# Altium project ADL5330_VGA.PrjPcb
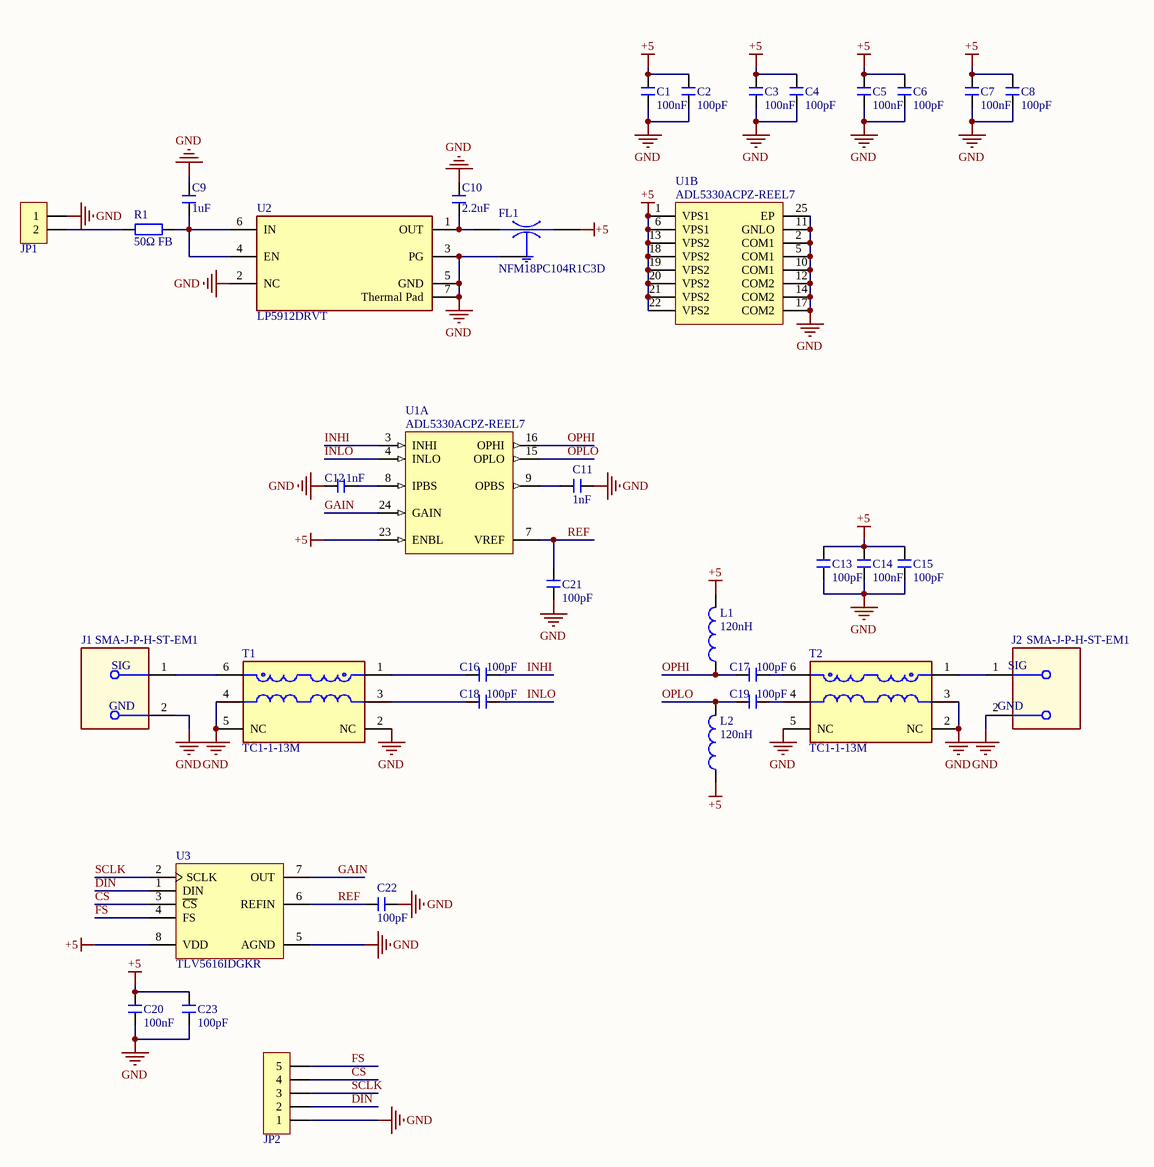
[diagram p0: ADL5330.SchDoc]
1 sheet, 36 parts. Net scope: global (net labels, ports and power ports of the same name join across sheets).
Board file: ADL5330.PcbDoc

## Sheet ADL5330.SchDoc
size A2; SheetNumber: 1; SheetTotal: 1

### Parts
C1  100nF  [C 0402_L]
C2  100pF  [C 0402_L]
C3  100nF  [C 0402_L]
C4  100pF  [C 0402_L]
C5  100nF  [C 0402_L]
C6  100pF  [C 0402_L]
C7  100nF  [C 0402_L]
C8  100pF  [C 0402_L]
C9  1uF  [C 0603_L]
C10  2.2uF  [C 0603_L]
C11  1nF  [C 0402_L]
C12  1nF  [C 0402_L]
C13  100pF  [C 0402_L]
C14  100nF  [C 0402_L]
C15  100pF  [C 0402_L]
C16  100pF  [C 0402_L]
C17  100pF  [C 0402_L]
C18  100pF  [C 0402_L]
C19  100pF  [C 0402_L]
C20  100nF  [C 0402_L]
C21  100pF  [C 0402_L]
C22  100pF  [C 0402_L]
C23  100pF  [C 0402_L]
FL1  NFM18PC104R1C3D  [FIL_NFM18PC104R1C3D]
J1  SMA-J-P-H-ST-EM1  [FP-SMA-J-P-H-ST-EM1-MFG]
J2  SMA-J-P-H-ST-EM1  [FP-SMA-J-P-H-ST-EM1-MFG]
JP1  HDR-1X2  [KF2510-LI-2P]  (value not drawn)
JP2  HDR-1X5  [HDR2.54-LI-5P]  (value not drawn)
L1  120nH  [L 0603]
L2  120nH  [L 0603]
R1  50Ω FB  [R 1206_L]
T1  TC1-1-13M  [FP-TC1-1-13M+-MFG]
T2  TC1-1-13M  [FP-TC1-1-13M+-MFG]
U1  ADL5330ACPZ-REEL7  [ADI-CP-24-2_L]  (parts A,B of 2)
U2  LP5912DRVT  [FP-DRV0006A-MFG]
U3  TLV5616IDGKR  [TI-DGK8_L]

### Nets
+5: C1.2 C2.2 C3.2 C4.2 C5.2 C6.2 C7.2 C8.2 C13.2 C14.2 C15.2 C20.2 C23.1 FL1.3(OUT) L1.2 L2.1 U1.1(VPS1) U1.6(VPS1) U1.13(VPS2) U1.18(VPS2) U1.19(VPS2) U1.20(VPS2) U1.21(VPS2) U1.22(VPS2) U1.23(ENBL) U3.8(VDD)
GND: C1.1 C2.1 C3.1 C4.1 C5.1 C6.1 C7.1 C8.1 C9.2 C10.2 C11.1 C12.1 C13.1 C14.1 C15.1 C20.1 C21.1 C22.1 C23.2 FL1.2(GND) J1.2(MNT_1) J2.2(MNT_1) JP1.1 JP2.1 T1.2(NC) T1.4(PRIMARY) T1.5(NC) T2.2(NC) T2.3(SECONDARY) T2.5(NC) U1.2(COM1) U1.5(COM1) U1.10(COM1) U1.11(GNLO) U1.12(COM2) U1.14(COM2) U1.17(COM2) U1.25(EP) U2.2(NC) U2.3(PG) U2.5(GND) U2.7(Thermal_Pad) U3.5(AGND)
~{CS}: JP2.4 U3.3(~{CS})
DIN: JP2.2 U3.1(DIN)
FS: JP2.5 U3.4(FS)
GAIN: U1.24(GAIN) U3.7(OUT)
INHI: C16.2 U1.3(INHI)
INLO: C18.2 U1.4(INLO)
OPHI: C17.1 L1.1 U1.16(OPHI)
OPLO: C19.1 L2.2 U1.15(OPLO)
REF: C21.2 C22.2 U1.7(VREF) U3.6(REFIN)
SCLK: JP2.3 U3.2(SCLK)
NetC9_1: C9.1 R1.2 U2.4(EN) U2.6(IN)
NetC10_1: C10.1 FL1.1(IN) U2.1(OUT)
NetC11_2: C11.2 U1.9(OPBS)
NetC12_2: C12.2 U1.8(IPBS)
NetC16_1: C16.1 T1.1(SECONDARY_DOT)
NetC17_2: C17.2 T2.6(PRIMARY_DOT)
NetC18_1: C18.1 T1.3(SECONDARY)
NetC19_2: C19.2 T2.4(PRIMARY)
NetJ1_1: J1.1 T1.6(PRIMARY_DOT)
NetJ2_1: J2.1 T2.1(SECONDARY_DOT)
NetJP1_2: JP1.2 R1.1

### Notes on the sheet
- (in symbol CMP-02754-000006-1) SIG; GND

### Library data of the parts
C1-C23 = C: 贴片电容; 淘宝ID: 小糖豆的小窝窝; BOM名称: 贴片电容; 下单链接: https://item.taobao.com/item.htm?ft=t&id=613637044352
FL1 = NFM18PC104R1C3D: SMD Capacitor with Capacitance: 0.10uF Tol. 20%. Rated Voltage: 16Vdc; MF: Murata; Digi-Key_Part_Number: 490-6969-1-ND; SnapEDA_Link: https://www.snapeda.com/parts/NFM18PC104R1C3D/Murata/view-part/4375738/?ref=snap; Package: NONSTANDARD; MP: NFM18PC104R1C3D; Digi-Key_Purchase_URL: https://www.digikey.com/product-detail/en/murata-electronics/NFM18PC104R1C3D/490-6969-1-ND/3846166?utm_source=snapeda&utm_medium=aggregator&utm_campaign=symbol; Value: *
J1 J2 = CMP-02754-000006-1: CONN SMA JACK STR 50OHM EDGE MNT; Center Contact Plating: Gold; Voltage Rating: 335V; Impedance: 50R; Max Frequency: 6GHz; Body Material: Brass; Dielectric Material: PTFE; Connector Type: SMA; Series: SMA; Fastening Type: Threaded; Depth: 13.33mm; Max Operating Temperature: 125°C; Termination: Solder; Length: 6.35mm; Radiation Hardening: No; RoHS Compliant: Yes; Insulation Material: Polytetrafluoroethylene; Min Operating Temperature: -65°C; Packaging: Tray; Housing Color: Gold; Body Plating: Gold; Mount: Edge; Contact Material: Copper; Orientation: Straight; Package Quantity: 1; Contact Plating: Gold; Case/Package: SMA
JP1 = Header 2: 2P接插件; 淘宝ID: 小糖豆的小窝窝; BOM名称: 2P接插件; 下单链接: https://item.taobao.com/item.htm?ft=t&id=613637044352
JP2 = Header 5: 5P接插件; 淘宝ID: 小糖豆的小窝窝; BOM名称: 5P接插件; 下单链接: https://item.taobao.com/item.htm?ft=t&id=613637044352
L1 L2 = L: 小功率贴片电感; BOM名称: 小功率贴片电感; 下单链接: https://item.taobao.com/item.htm?ft=t&id=613637044352
R1 = R: 贴片电阻; 淘宝ID: 小糖豆的小窝窝; BOM名称: 贴片电阻; 下单链接: https://item.taobao.com/item.htm?ft=t&id=613637044352
T1 T2 = TC1-1-13M: RF Transformer 1: 1 5 Terminal SMD; RoHS Compliant: Yes
U1 = ADL5330ACPZ: 10 MHz to 3 GHz VGA with 60 dB Gain Control Range, 3GHz, CP-24-2, 1500 Reel, Pb-Free; Output IP3: 31dBm; Gain High End: 22dB; Noise Figure: 14.7dB; Supply Current: 215mA; Gain Low End: -34dB; 1 dB Comp Point: 1.2dBm; PackageDescription: 24-Lead Lead Frame Chip Scale Package [LFCSP_VQ]; ComponentLink1Description: Manufacturer URL; ComponentLink1URL: www.analog.com; ComponentLink3Description: Package Specification; ComponentLink3URL: http://www.analog.com/static/imported-files/packages/588305704543880784658541CP_24_2.pdf; ComponentLink2Description: Datasheet; PackageVersion: Jan-2005; RF Frquency Range (MHz): 3GHz; ComponentLink2URL: http://www.analog.com/static/imported-files/data_sheets/ADL5330.pdf; PackageReference: CP-24-2; Code_JEDEC: MO-220-VGGD-2; DatasheetVersion: Rev. A
U2 = LP5912DRVT: IC REG LINEAR 500MA 6SON; Dropout Voltage: 950mV; Quiescent Current: 30uA; Output Voltage: 3.3V; Number of Regulators: 1; Min Operating Temperature: -40°C; Number of Pins: 6; Max Operating Temperature: 125°C; RoHS Compliant: Yes; Packaging: Tape and Reel; Output Current: 500mA; Mount: Surface Mount; Lead Free: Lead Free
U3 = CMP-0004-00436-1: 12-Bit, 3 us DAC, Serial Input, Programmable Settling Time / Power Consumption, -40 to 85 degC, 8-pin SOP (DGK8), Green (RoHS & no Sb/Br); Manufacturer: Texas Instruments; SubFamily: Precision DAC (=<10MSPS); DAC Channels: 1; SFDR(dB): 70; Settling Time(us): 3; SNR(dB): 74; Resolution(Bits): 12; Power Consumption(Typ)(mW): 0.9; INL(Max)(+/-LSB): 4; Interface: Serial SPI; Code_JEDEC: MO-187; PackageDescription: 8-Pin Thin Small Outline, Body 3 x 3 mm, Pitch 0.65 mm; DNL(Max)(+/-LSB): 1; PartNumber: TLV5616IDGKR; Eco-Plan: Green (RoHS & no Sb/Br); ComponentLink3Description: Package Specification; Mounting Technology: Surface Mount; ComponentLink3URL: http://www.ti.com/litv/pdf/mpds028d; DatasheetVersion: SLAS152D; ComponentLink1URL: http://www.ti.com/; PackageReference: DGK8; ComponentLink1Description: Manufacturer URL; PackageVersion: 4073329/E, 05/2006; ComponentLink2Description: Datasheet; ComponentLink2URL: http://www.ti.com/general/docs/lit/getliterature.tsp?genericPartNumber=TLV5616&fileType=pdf